# Altium schematic sheet DS141-1.1-A循环式二氧化碳.SchDoc
size A3; SheetNumber: 1; SheetTotal: 2
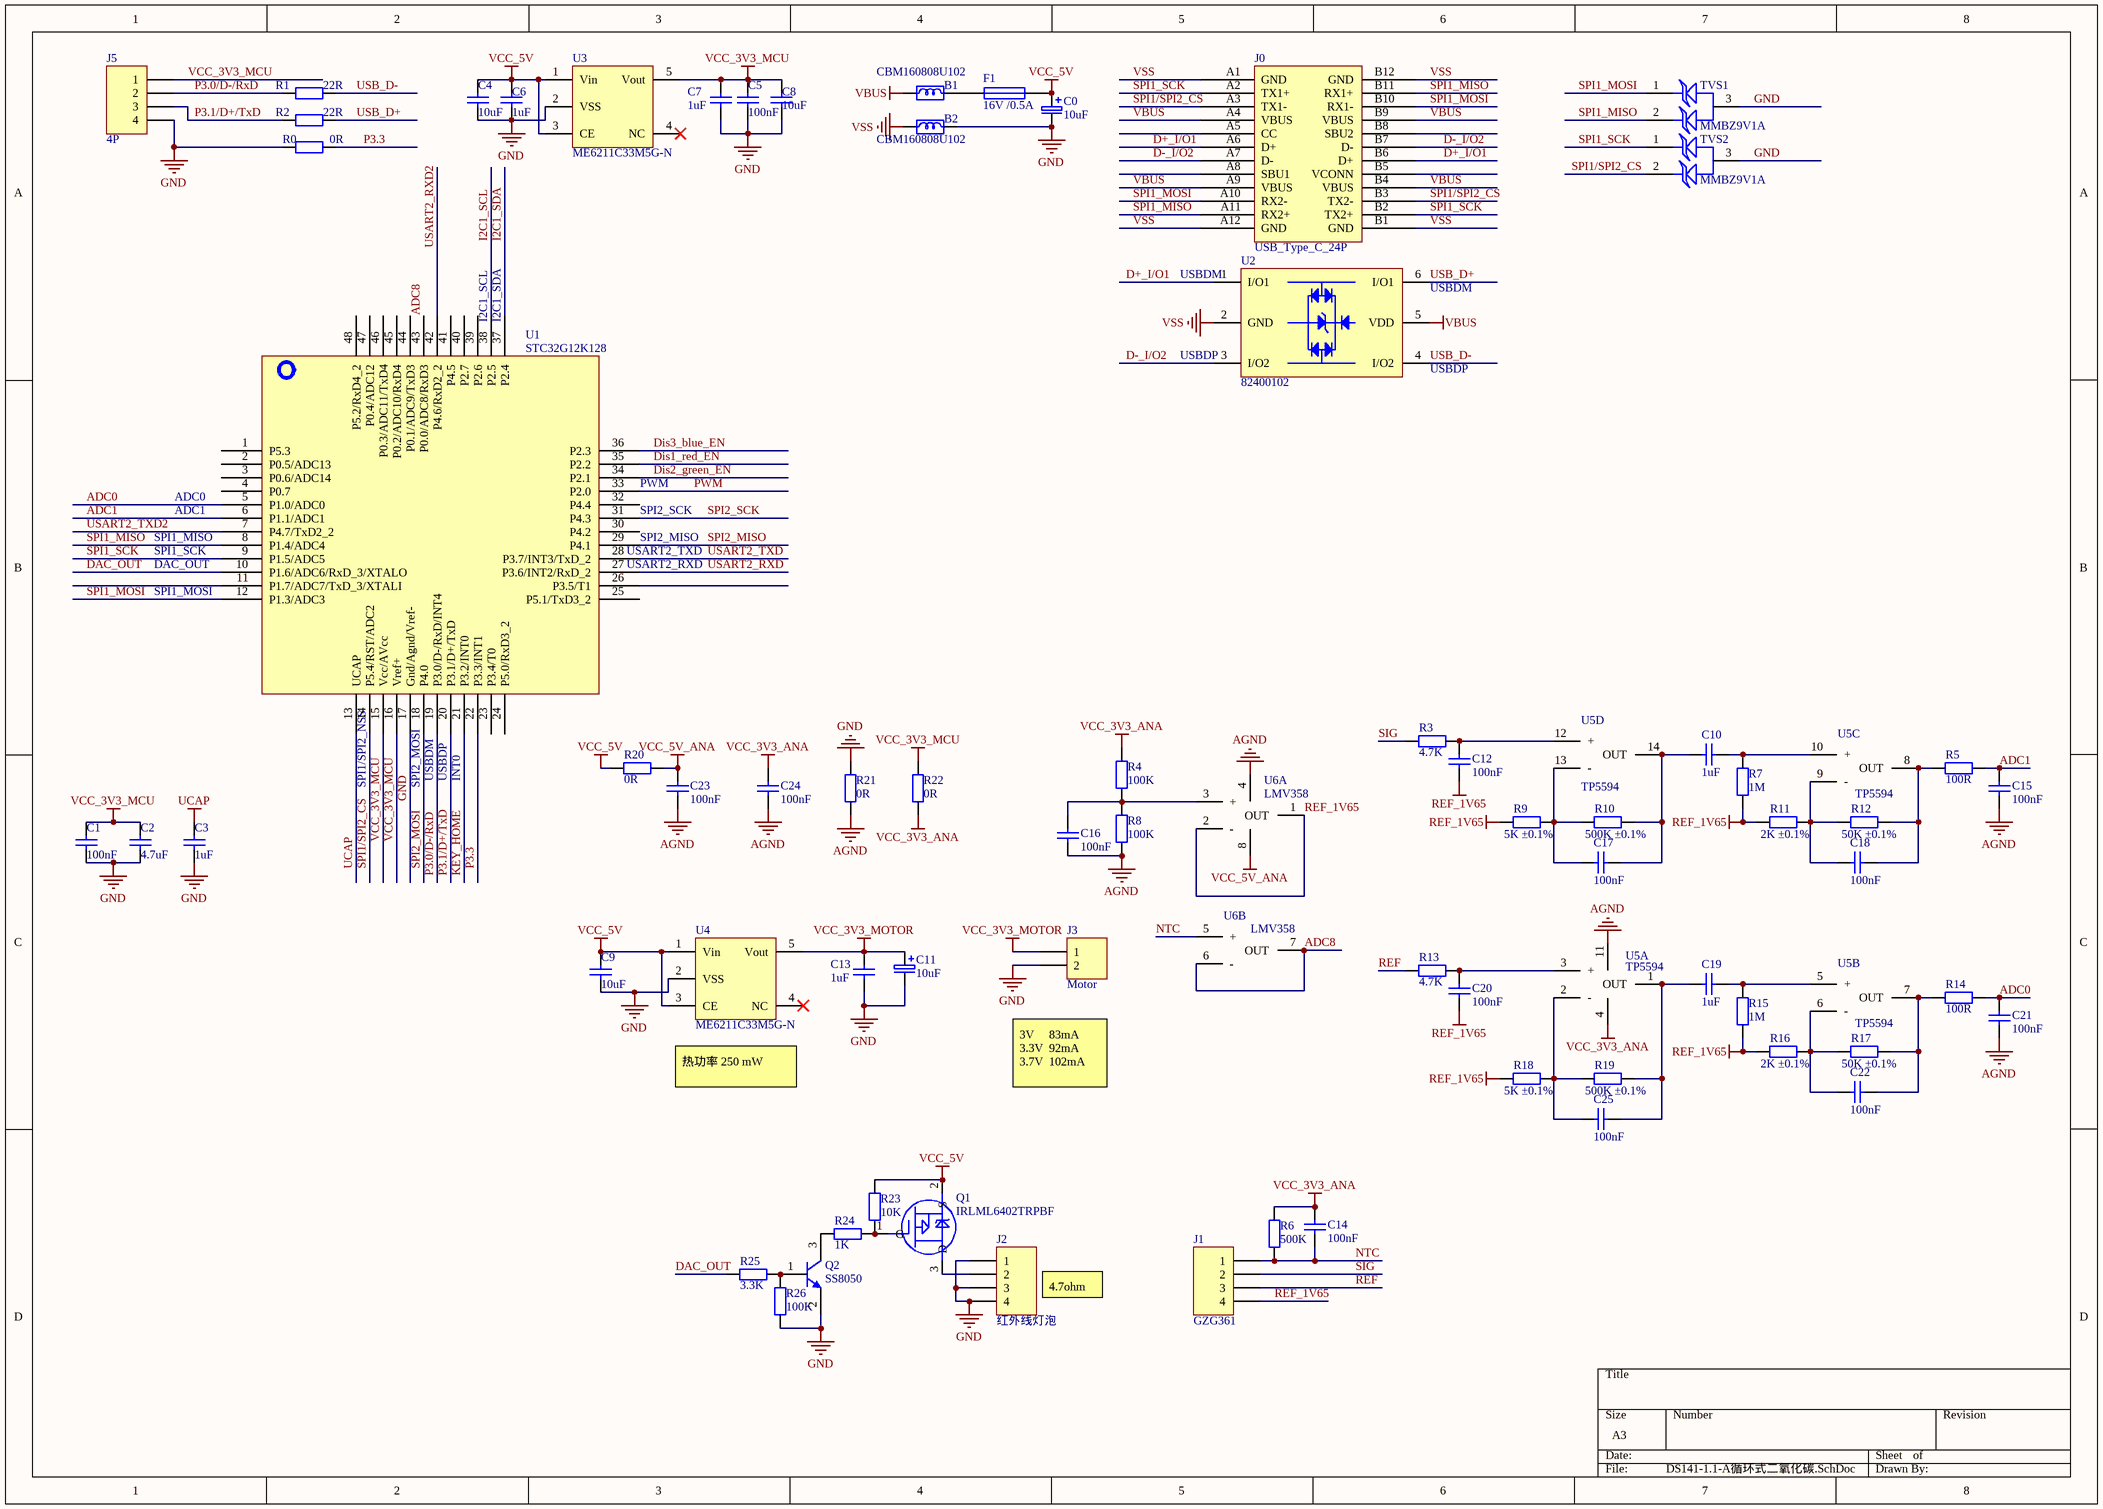
[diagram p0: DS141-1.1-A循环式二氧化碳.SchDoc]

## Parts
B1  CBM160808U102  [0603Bead]
B2  CBM160808U102  [0603Bead]
C0  value 10uF  [AVX_3216-18(1206)_SMD]  (hidden comment: AVX_10uF/16V ±10％(C106))
C1  value 100nF  [0603CAP]  (hidden comment: SMDCAP00013)
C2  value 4.7uF  [0603CAP]  (hidden comment: SMDCAP00012)
C3  value 1uF  [0603CAP]  (hidden comment: SMDCAP00015)
C4  value 10uF  [1206CAP]  (hidden comment: MLCC 10uF 50V ±20％ 1206)
C5  value 100nF  [0603CAP]  (hidden comment: SMDCAP00013)
C6  value 1uF  [0603CAP]  (hidden comment: SMDCAP00015)
C7  value 1uF  [0603CAP]  (hidden comment: SMDCAP00015)
C8  value 10uF  [1206CAP]  (hidden comment: MLCC 10uF 50V ±20％ 1206)
C9  value 10uF  [1206CAP]  (hidden comment: MLCC 10uF 50V ±20％ 1206)
C10  value 1uF  [0603CAP]  (hidden comment: SMDCAP00015)
C11  value 10uF  [AVX_3216-18(1206)_SMD]  (hidden comment: AVX_10uF/16V ±10％(C106))
C12  value 100nF  [0603CAP]  (hidden comment: SMDCAP00013)
C13  value 1uF  [0603CAP]  (hidden comment: SMDCAP00015)
C14  value 100nF  [0603CAP]  (hidden comment: SMDCAP00013)
C15  value 100nF  [0603CAP]  (hidden comment: SMDCAP00013)
C16  value 100nF  [0603CAP]  (hidden comment: SMDCAP00013)
C17  value 100nF  [0603CAP]  (hidden comment: SMDCAP00013)
C18  value 100nF  [0603CAP]  (hidden comment: SMDCAP00013)
C19  value 1uF  [0603CAP]  (hidden comment: SMDCAP00015)
C20  value 100nF  [0603CAP]  (hidden comment: SMDCAP00013)
C21  value 100nF  [0603CAP]  (hidden comment: SMDCAP00013)
C22  value 100nF  [0603CAP]  (hidden comment: SMDCAP00013)
C23  value 100nF  [0603CAP]  (hidden comment: SMDCAP00013)
C24  value 100nF  [0603CAP]  (hidden comment: SMDCAP00013)
C25  value 100nF  [0603CAP]  (hidden comment: SMDCAP00013)
F1  value 16V /0.5A  [1206FUSE]  (hidden comment: SMD1206-050C-16V)
J0  USB_Type_C_24P  [USB_TYPE_C_24P_Receptacle]
J1  value GZG361  [CO2_connecet_4p]  (hidden comment: SL000000034)
J2  value 红外线灯泡  [CO2_connecet_4p]  (hidden comment: SL000000029)
J3  value Motor  [SIP2]  (hidden comment: SL000000042)
J5  value 4P  [H4]  (hidden comment: DIP4单排直针  间距2mm 针长11mm 铜)
Q1  value IRLML6402TRPBF  [SOT23]  (hidden comment: SMDPMOS00001)
Q2  value SS8050  [SOT23]  (hidden comment: SMDNPN00001)
R0  value 0R  [0603RES]  (hidden comment: Chip 0R 1/16W ±1％ 0603)
R1  value 22R  [0603RES]  (hidden comment: Chip 22R 1/16W ±1％ 0603)
R2  value 22R  [0603RES]  (hidden comment: Chip 22R 1/16W ±1％ 0603)
R3  value 4.7K  [0603RES]  (hidden comment: SMDRES00047)
R4  value 100K  [0603RES]  (hidden comment: SMDRES00071)
R5  value 100R  [0603RES]  (hidden comment: SMDRES00015)
R6  value 500K  [0603RES]  (hidden comment: Chip 500K 1/10W ±1% 0603)
R7  value 1M  [0603RES]  (hidden comment: SMDRES00085)
R8  value 100K  [0603RES]  (hidden comment: SMDRES00071)
R9  value 5K ±0.1%  [0603RES]  (hidden comment: Chip 5K 1/10W ±0.1％ 0603)
R10  value 500K ±0.1%  [0603RES]  (hidden comment: Chip 500K 1/10W ±0.1% 0603)
R11  value 2K ±0.1%  [0603RES]  (hidden comment: Chip 2K 1/10W ±0.1％ 0603)
R12  value 50K ±0.1%  [0603RES]  (hidden comment: Chip 50K 1/10W ±0.1％ 0603)
R13  value 4.7K  [0603RES]  (hidden comment: SMDRES00047)
R14  value 100R  [0603RES]  (hidden comment: SMDRES00015)
R15  value 1M  [0603RES]  (hidden comment: SMDRES00085)
R16  value 2K ±0.1%  [0603RES]  (hidden comment: Chip 2K 1/10W ±0.1％ 0603)
R17  value 50K ±0.1%  [0603RES]  (hidden comment: Chip 50K 1/10W ±0.1％ 0603)
R18  value 5K ±0.1%  [0603RES]  (hidden comment: Chip 5K 1/10W ±0.1％ 0603)
R19  value 500K ±0.1%  [0603RES]  (hidden comment: Chip 500K 1/10W ±0.1% 0603)
R20  value 0R  [0603RES]  (hidden comment: Chip 0R 1/16W ±1％ 0603)
R21  value 0R  [0603RES]  (hidden comment: Chip 0R 1/16W ±1％ 0603)
R22  value 0R  [0603RES]  (hidden comment: Chip 0R 1/16W ±1％ 0603)
R23  value 10K  [0603RES]  (hidden comment: SMDRES00056)
R24  value 1K  [0603RES]  (hidden comment: SMDRES00034)
R25  value 3.3K  [0603RES]  (hidden comment: SMDRES00090)
R26  value 100K  [0603RES]  (hidden comment: SMDRES00071)
TVS1  MMBZ9V1A  [SOT23]
TVS2  MMBZ9V1A  [SOT23]
U1  value STC32G12K128  [LQFP-48]  (hidden comment: STC32G12K128_35I LQFP48)
U2  82400102  [SOT23-6]
U3  ME6211C33M5G-N  [SOT23-5]
U4  ME6211C33M5G-N  [SOT23-5]
U5  value TP5594  [TSSOP14]  (hidden comment: TP5594-TR  TSSOP-14)  (parts A,B,C,D of 4)
U6  value LMV358  [VSSOP-8-H-1.1]  (hidden comment: LMV358IDGKR  VSSOP-8)  (parts A,B of 2)

## Nets
AGND: C15.2 C16.1 C21.2 C23.1 C24.1 R8.1 R21.2 U5.11(GND) U6.4(GND)
GND: B2.2 C0.2 C1.1 C2.1 C3.1 C4.1 C5.1 C6.1 C7.1 C8.1 C9.1 C11.2 C13.1 J2.1 J2.3 J2.4 J3.2 J5.4 Q2.2(E) R0.1 R21.1 R26.2 TVS1.3 TVS2.3 U1.17(Gnd/Agnd/Vref-) U3.2(VSS) U4.2(VSS)
REF_1V65: C12.2 C20.2 J1.4 R7.1 R9.1 R11.2 R15.1 R16.2 R18.1 U6.1(OUT) U6.2(-)
UCAP: C3.2 U1.13(UCAP)
VBUS: B1.1 J0.A4(VBUS) J0.A9(VBUS) J0.B4(VBUS) J0.B9(VBUS) U2.5(VDD)
VCC_3V3_ANA: C14.2 C24.2 R4.2 R6.2 R22.2 U5.4(VSS)
VCC_3V3_MCU: C1.2 C2.2 C5.2 C7.2 C8.2 J5.1 R22.1 U1.15(Vcc/AVcc) U1.16(Vref+) U3.5(Vout)
VCC_3V3_MOTOR: C11.1 C13.2 J3.1 U4.5(Vout)
VCC_5V: C0.1 C4.2 C6.2 C9.2 F1.2 Q1.2(S) R20.1 R23.1 U3.1(Vin) U3.3(CE) U4.1(Vin) U4.3(CE)
VCC_5V_ANA: C23.2 R20.2 U6.8(VCC)
VSS: B2.1 J0.A1(GND) J0.A12(GND) J0.B1(GND) J0.B12(GND) U2.2(GND)
ADC0: C21.1 R14.2 U1.5(P1.0/ADC0)
ADC1: C15.1 R5.2 U1.6(P1.1/ADC1)
ADC8: U1.43(P0.0/ADC8/RxD3) U6.6(-) U6.7(OUT)
D+_I/O1: J0.A6(D+) J0.B6(D+) U2.1(I/O1)
D-_I/O2: J0.A7(D-) J0.B7(D-) U2.3(I/O2)
DAC_OUT: R25.2 U1.10(P1.6/ADC6/RxD_3/XTALO)
Dis1_red_EN: U1.35(P2.2)
Dis2_green_EN: U1.34(P2.1)
Dis3_blue_EN: U1.36(P2.3)
I2C1_SCL: U1.38(P2.5)
I2C1_SDA: U1.37(P2.4)
KEY_HOME: U1.21(P3.2/INT0)
NTC: C14.1 J1.1 R6.1 U6.5(+)
P3.0/D-/RxD: J5.2 R1.1 U1.19(P3.0/D-/RxD/INT4)
P3.1/D+/TxD: J5.3 R2.1 U1.20(P3.1/D+/TxD)
P3.3: R0.2 U1.22(P3.3/INT1)
PWM: U1.33(P2.0)
REF: J1.3 R13.1
SIG: J1.2 R3.1
SPI1/SPI2_CS: J0.A3(TX1-) J0.B3(TX2-) TVS2.2 U1.14(P5.4/RST/ADC2)
SPI1_MISO: J0.A11(RX2+) J0.B11(RX1+) TVS1.2 U1.8(P1.4/ADC4)
SPI1_MOSI: J0.A10(RX2-) J0.B10(RX1-) TVS1.1 U1.12(P1.3/ADC3)
SPI1_SCK: J0.A2(TX1+) J0.B2(TX2+) TVS2.1 U1.9(P1.5/ADC5)
SPI2_MISO: U1.29(P4.1)
SPI2_MOSI: U1.18(P4.0)
SPI2_SCK: U1.31(P4.3)
USART2_RXD: U1.27(P3.6/INT2/RxD_2)
USART2_RXD2: U1.42(P4.6/RxD2_2)
USART2_TXD: U1.28(P3.7/INT3/TxD_2)
USART2_TXD2: U1.7(P4.7/TxD2_2)
USB_D+: R2.2 U2.6(I/O1)
USB_D-: R1.2 U2.4(I/O2)
NetB1_2: B1.2 F1.1
NetC10_1: C10.1 C17.2 R10.2 U5.14(OUT)
NetC10_2: C10.2 R7.2 U5.10(+)
NetC12_1: C12.1 R3.2 U5.12(+)
NetC16_2: C16.2 R4.1 R8.2 U6.3(+)
NetC17_1: C17.1 R9.2 R10.1 U5.13(-)
NetC18_1: C18.1 R11.1 R12.1 U5.9(-)
NetC18_2: C18.2 R5.1 R12.2 U5.8(OUT)
NetC19_1: C19.1 C25.2 R19.2 U5.1(OUT)
NetC19_2: C19.2 R15.2 U5.5(+)
NetC20_1: C20.1 R13.2 U5.3(+)
NetC22_1: C22.1 R16.1 R17.1 U5.6(-)
NetC22_2: C22.2 R14.1 R17.2 U5.7(OUT)
NetC25_1: C25.1 R18.2 R19.1 U5.2(-)
NetJ2_2: J2.2 Q1.3(D)
NetQ1_1: Q1.1(G) R23.2 R24.2
NetQ2_1: Q2.1(B) R25.1 R26.1
NetQ2_3: Q2.3(C) R24.1

Not connected (* = marked no-connect by the designer): J0 A5(CC) A8(SBU1) B5(VCONN) B8(SBU2); U1 1(P5.3) 2(P0.5/ADC13) 3(P0.6/ADC14) 4(P0.7) 11(P1.7/ADC7/TxD_3/XTALI) 23(P3.4/T0) 24(P5.0/RxD3_2) 25(P5.1/TxD3_2) 26(P3.5/T1) 30(P4.2) 32(P4.4) 39(P2.6) 40(P2.7) 41(P4.5) 44(P0.1/ADC9/TxD3) 45(P0.2/ADC10/RxD4) 46(P0.3/ADC11/TxD4) 47(P0.4/ADC12) 48(P5.2/RxD4_2); U3 4(NC)*; U4 4(NC)*

## Notes on the sheet
- (near U1) I2C1_SCL
- (near U1) I2C1_SDA
- (near U2) USBDM
- (near U2) USBDP
- ADC0
- ADC1
- (near U1) PWM
- (near U1) SPI2_SCK
- (near U1) SPI1_MISO
- SPI1_SCK
- DAC_OUT
- (near U1) USART2_TXD
- (near U1) USART2_RXD
- (near U1) SPI2_MISO
- (near U1) SPI1_MOSI
- (near U1) SPI1/SPI2_NSS
- (near U1) SPI2_MOSI
- USBDM
- USBDP
- INT0
- (near U4) 热功率 250 mW
- 3V     83mA
  3.3V  92mA
  3.7V  102mA
- (near J2) 4.7ohm

## Library data of the parts
B1 B2 = Chip Ferrite Bead 0606: 贴片磁珠
C0 C11 = AVX_10uF/16V ±10％(C106): 钽电容
C1 C5 C12 C14-C18 C20-C25 = MLCC 100nF 50V ±10％ 0603: 贴片电容
C2 = MLCC 4.7uF 50V ±10％ 0603: 贴片电容
C3 C6 C7 C10 C13 C19 = MLCC 1uF 50V ±10％ 0603: 贴片电容
C4 C8 C9 = MLCC 10uF 50V ±20％ 1206: 贴片电容
F1 = SMD1206-050C-16V: 贴片自恢复保险丝 16V /0.5A
J1 = XH2.54mm-4AW 弯针座: 4P弯针座
J2 = XH2.54mm-4A 直针座: 4P直针座
J3 = DIP2 单排直针 1*40P 间距2.54mm 针长11mm 铜: 单排直针
J5 = DIP4单排直针  间距2mm 针长11mm 铜: 单排直针
Q1 = IRLML6402TRPBF SOT-23 IR: 贴片P-MOS管
Q2 = SS8050 Y1 SOT-23: 贴片三极管
R0 R20-R22 = Chip 0R 1/16W ±1％ 0603: 贴片电阻
R1 R2 = Chip 22R 1/16W ±1％ 0603: 贴片电阻
R3 R13 = Chip 4.7K 1/10W ±1％ 0603: 贴片电阻
R4 R8 R26 = Chip 100K 1/16W ±1％ 0603: 贴片电阻
R5 R14 = Chip 100R 1/16W ±1％ 0603: 贴片电阻
R7 R15 = Chip 1M 1/16W ±1％ 0603: 贴片电阻
R23 = Chip 10K 1/16W ±1％ 0603: 贴片电阻
R24 = Chip 1K 1/16W ±1％ 0603: 贴片电阻
R25 = Chip 3.3K 1/16W ±1％ 0603: 贴片电阻
TVS1 TVS2 = TVS: 瞬态抑制二极管
U1 = STC32G12K128_35I LQFP48: 单片机芯片
U2 = 82400102: 瞬态抑制二极管(TVS)
U3 U4 = ME6211C33M5G-N: 稳压芯片
U6 = LMV358IDGKR  VSSOP-8: 双路、5.5V、1MHz、4mV 失调电压、RRO 运算放大器